# Altium schematic sheet Schema.SchDoc
size A4
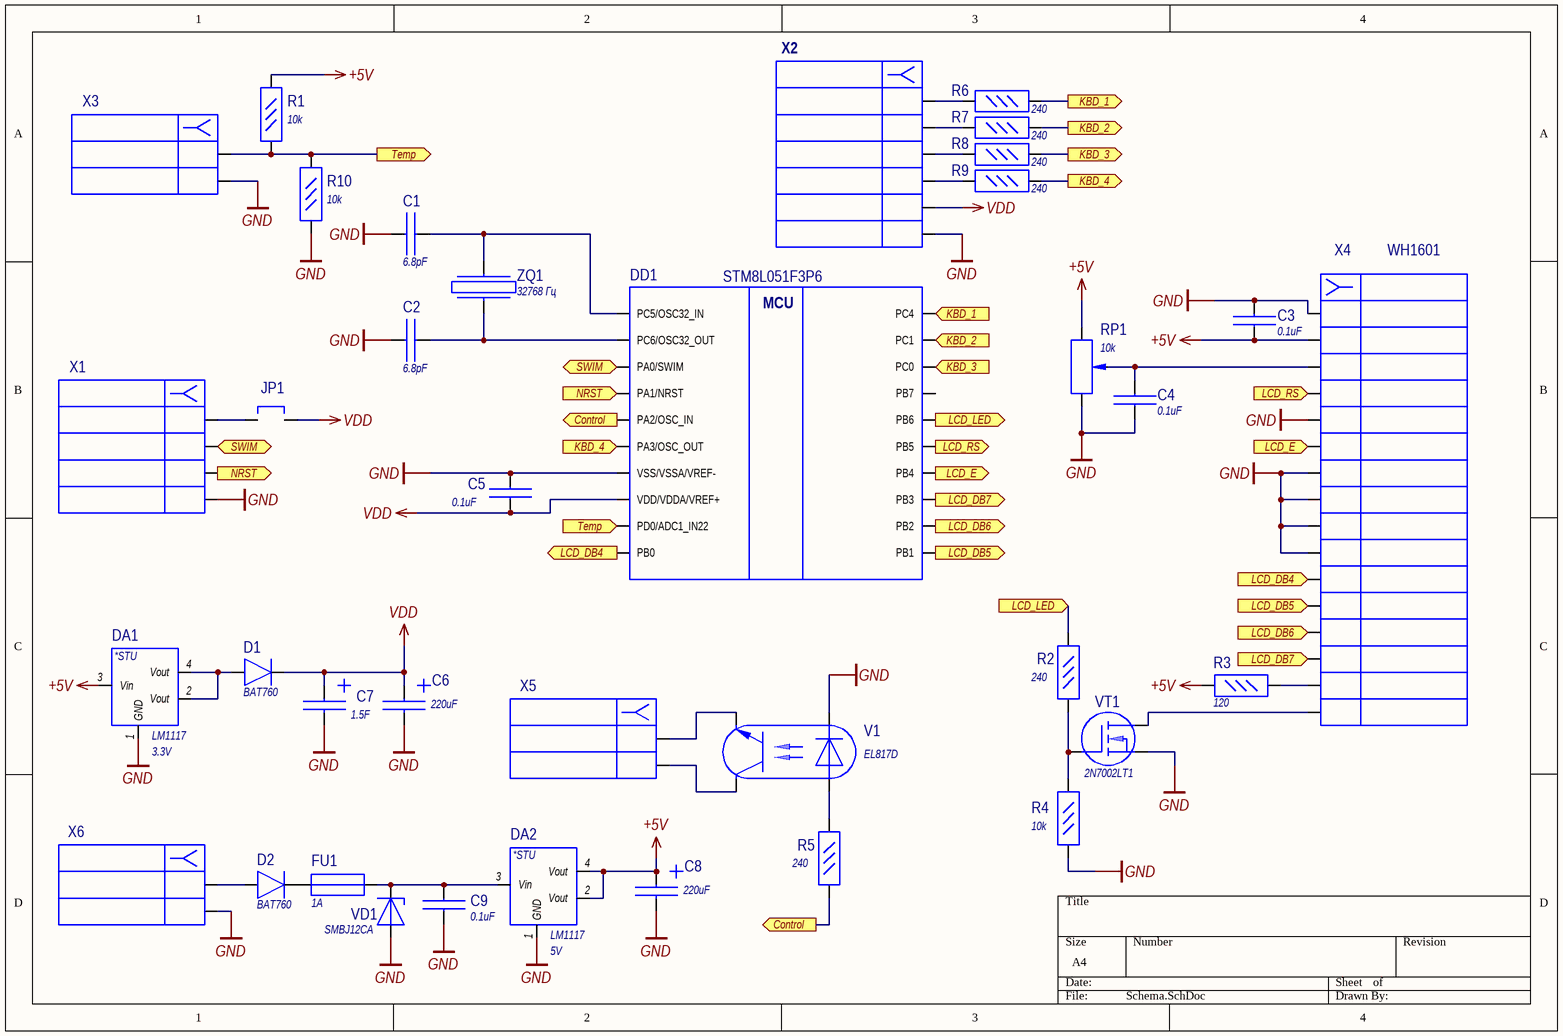
[diagram p0: Schema.SchDoc]

## Parts
C1  Cap: 6.8pF  [CAPACITOR SMD 1206]  (hidden comment: Capacitor)
C2  Cap: 6.8pF  [CAPACITOR SMD 1206]  (hidden comment: Capacitor)
C3  Cap: 0.1uF  [CAPACITOR SMD 1206]  (hidden comment: Capacitor)
C4  Cap: 0.1uF  [CAPACITOR SMD 1206]  (hidden comment: Capacitor)
C5  Cap: 0.1uF  [CAPACITOR SMD 1206]  (hidden comment: Capacitor)
C6  Cap: 220uF  [BigCapacitor]  (hidden comment: Capacitor (Polarized))
C7  Cap: 1.5F  [Ionistor]  (hidden comment: Ionistor)
C8  Cap: 220uF  [BigCapacitor]  (hidden comment: Capacitor (Polarized))
C9  Cap: 0.1uF  [CAPACITOR SMD 1206]  (hidden comment: Capacitor)
D1  BAT760  [SODFL250X110-2N]
D2  BAT760  [SODFL250X110-2N]
DA1  type: *STU  Vout: 3.3V  [SOT230P700X180-4N]  (hidden comment: LM1117)
DA2  type: *STU  Vout: 5V  [SOT230P700X180-4N]  (hidden comment: LM1117)
DD1  STM8L051F3P6  [TSOP65P640X120-20N]
FU1  1A  [Resistor SMD 1206]
JP1  Jumper  [Jumper]  (value not drawn)
R1  R: 10k  [Resistor SMD 1206]  (hidden comment: Resistor (0.05W))
R2  R: 240  [Resistor SMD 1206]  (hidden comment: Resistor (0.05W))
R3  R: 120  [Resistor SMD 1206]  (hidden comment: Resistor (0.05W))
R4  R: 10k  [Resistor SMD 1206]  (hidden comment: Resistor (0.05W))
R5  R: 240  [Resistor SMD 1206]  (hidden comment: Resistor (0.05W))
R6  R: 240  [Resistor SMD 1206]  (hidden comment: Resistor (0.05W))
R7  R: 240  [Resistor SMD 1206]  (hidden comment: Resistor (0.05W))
R8  R: 240  [Resistor SMD 1206]  (hidden comment: Resistor (0.05W))
R9  R: 240  [Resistor SMD 1206]  (hidden comment: Resistor (0.05W))
R10  R: 10k  [Resistor SMD 1206]  (hidden comment: Resistor (0.05W))
RP1  Resistance: 10k  [Var Resistor]  (hidden comment: Variable_Resistor)
V1  EL817D  [PC817]
VD1  SMBJ12CA  [SMB Supressor]
VT1  MOSFET  [SOT95P245X110-3N]  (value not drawn)
X1  SWIM_Connector  [SWIM Connector]  (value not drawn)
X2  KBD_Connector  [KBD_Connector]  (value not drawn)
X3  OptOutput  [Jumper]  (value not drawn)
X4  WH1601  [WH1601]
X5  OptOutput  [Jumper]  (value not drawn)
X6  OptOutput  [Jumper]  (value not drawn)
ZQ1  value 32768 Гц  [KX-26]  (hidden comment: Oscillator_small)

## Ports
Control, KBD_1, KBD_2, KBD_3, KBD_4, LCD_DB4, LCD_DB5, LCD_DB6, LCD_DB7, LCD_E, LCD_LED, LCD_RS, NRST, SWIM, Temp

## Nets
+5V: C3.1 C8.1 DA1.3(Vin) DA2.2(Vout) DA2.4(Vout) R1.1 R3.2 RP1.1 X4.2
GND: C1.1 C2.1 C3.2 C4.1 C5.1 C6.2 C7.2 C8.2 C9.2 DA1.1(GND) DA2.1(GND) DD1.7(VSS/VSSA/VREF-) R4.1 R10.2 RP1.2 V1.2 VD1.1 VT1.2 X1.4 X2.6 X3.2 X4.1 X4.5 X4.7 X4.8 X4.9 X4.10 X6.2
VDD: C5.2 C6.1 C7.1 D1.2 DD1.8(VDD/VDDA/VREF+) JP1.2 X2.5
Control: DD1.5(PA2/OSC_IN) R5.1 ; port Control
KBD_1: DD1.20(PC4) R6.2 ; port KBD_1
KBD_2: DD1.19(PC1) R7.2 ; port KBD_2
KBD_3: DD1.18(PC0) R8.2 ; port KBD_3
KBD_4: DD1.6(PA3/OSC_OUT) R9.2 ; port KBD_4
LCD_DB4: DD1.10(PB0) X4.11 ; port LCD_DB4
LCD_DB5: DD1.11(PB1) X4.12 ; port LCD_DB5
LCD_DB6: DD1.12(PB2) X4.13 ; port LCD_DB6
LCD_DB7: DD1.13(PB3) X4.14 ; port LCD_DB7
LCD_E: DD1.14(PB4) X4.6 ; port LCD_E
LCD_LED: DD1.16(PB6) R2.2 ; port LCD_LED
LCD_RS: DD1.15(PB5) X4.4 ; port LCD_RS
NRST: DD1.4(PA1/NRST) X1.3 ; port NRST
SWIM: DD1.3(PA0/SWIM) X1.2 ; port SWIM
Temp: DD1.9(PD0/ADC1_IN22) R1.2 R10.1 X3.1 ; port Temp
NetC1_2: C1.2 DD1.1(PC5/OSC32_IN) ZQ1.2
NetC2_2: C2.2 DD1.2(PC6/OSC32_OUT) ZQ1.1
NetC4_2: C4.2 RP1.3 X4.3
NetC9_1: C9.1 DA2.3(Vin) FU1.2 VD1.2
NetD1_1: D1.1 DA1.2(Vout) DA1.4(Vout)
NetD2_1: D2.1 X6.1
NetD2_2: D2.2 FU1.1
NetJP1_1: JP1.1 X1.1
NetR2_1: R2.1 R4.2 VT1.1
NetR3_1: R3.1 X4.15
NetR5_2: R5.2 V1.1
NetR6_1: R6.1 X2.1
NetR7_1: R7.1 X2.2
NetR8_1: R8.1 X2.3
NetR9_1: R9.1 X2.4
NetV1_3: V1.3 X5.2
NetV1_4: V1.4 X5.1
NetVT1_3: VT1.3 X4.16

Not connected (* = marked no-connect by the designer): DD1 17(PB7)

## Notes on the sheet
- (in symbol MOSFET) 2N7002LT1
- (in symbol STM8L051F3P6 (TSSOP-20)) MCU

## Library data of the parts
C6 C8 = Capacitor (Polarized): pin to pad: 1>2 2>1
C7 = Ionistor: pin to pad: 1>2 2>1
D1 D2 = Diode: pin to pad: 1>2 2>1
DD1 = STM8L051F3P6 (TSSOP-20)
FU1 = Fuse
V1 = Optocoupler
VD1 = Supressor: pin to pad: 1>2 2>1
X2 = KBD_Connector: pin to pad: 4>6 6>4
DA1 DA2 = LM1117: name: LM1117